# EasyEDA Pro project WEN-多通道电源模块mmk.epro, board PCB43
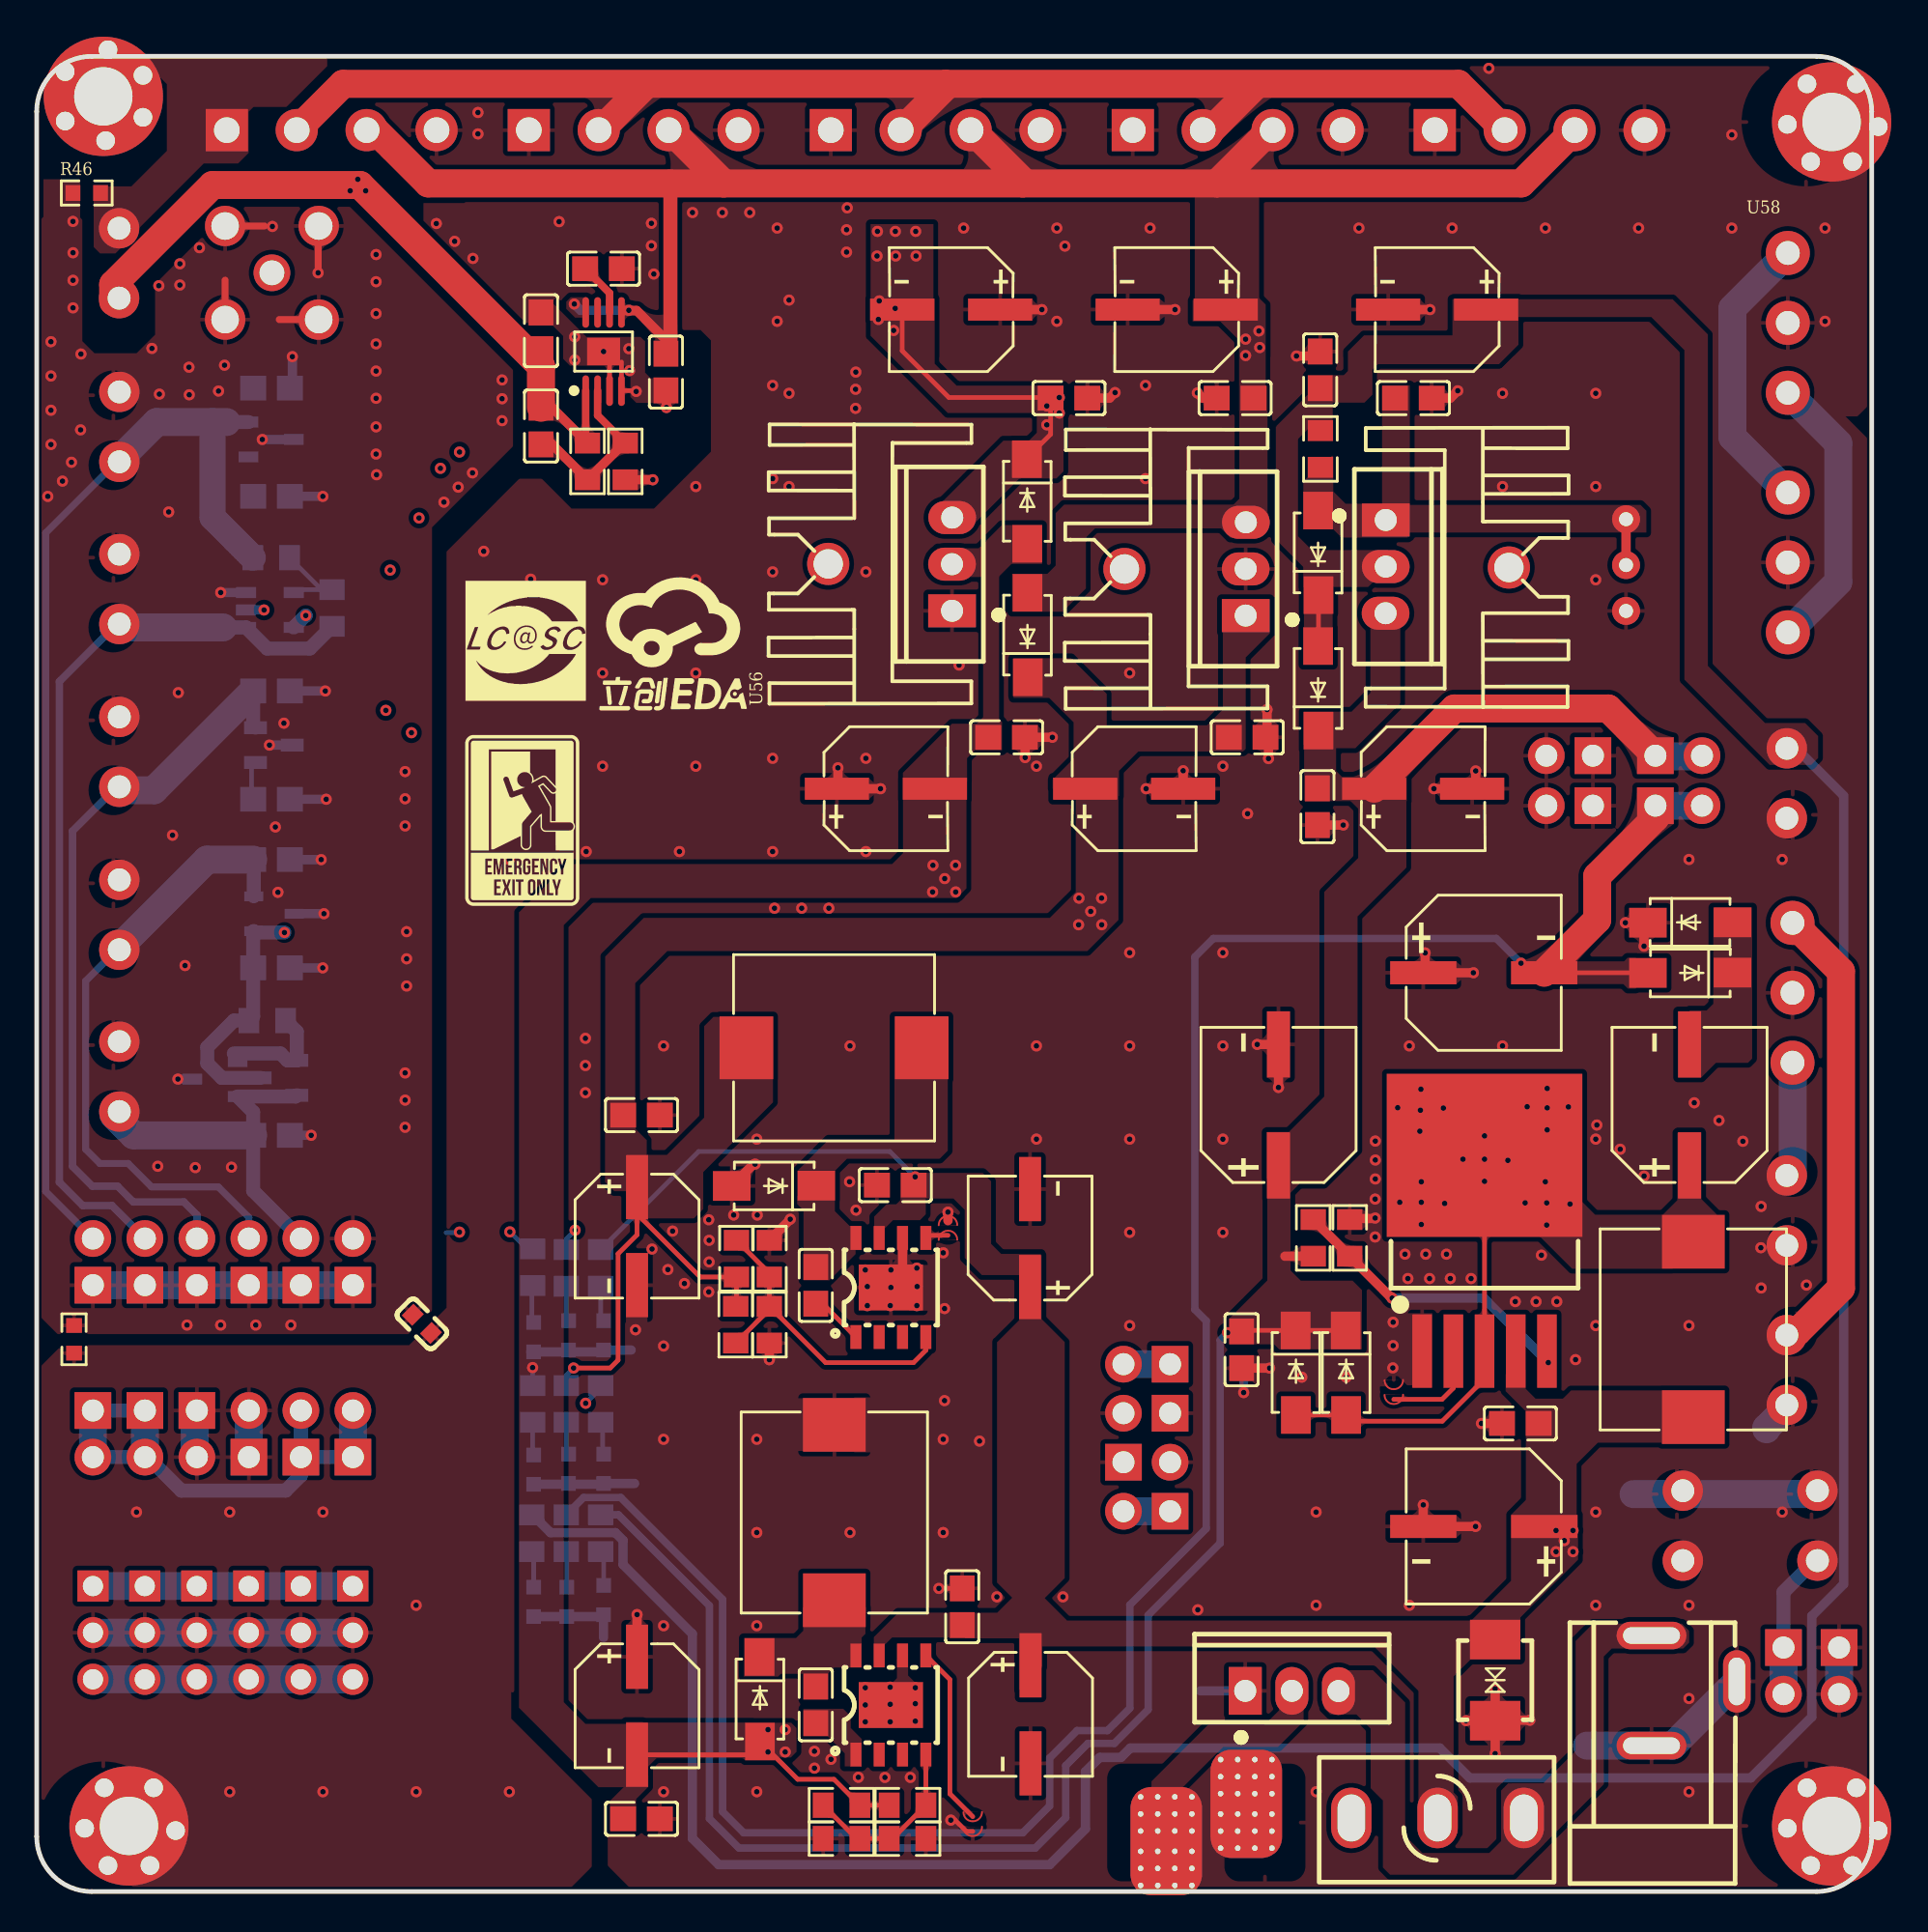
[diagram p6: board, top side]
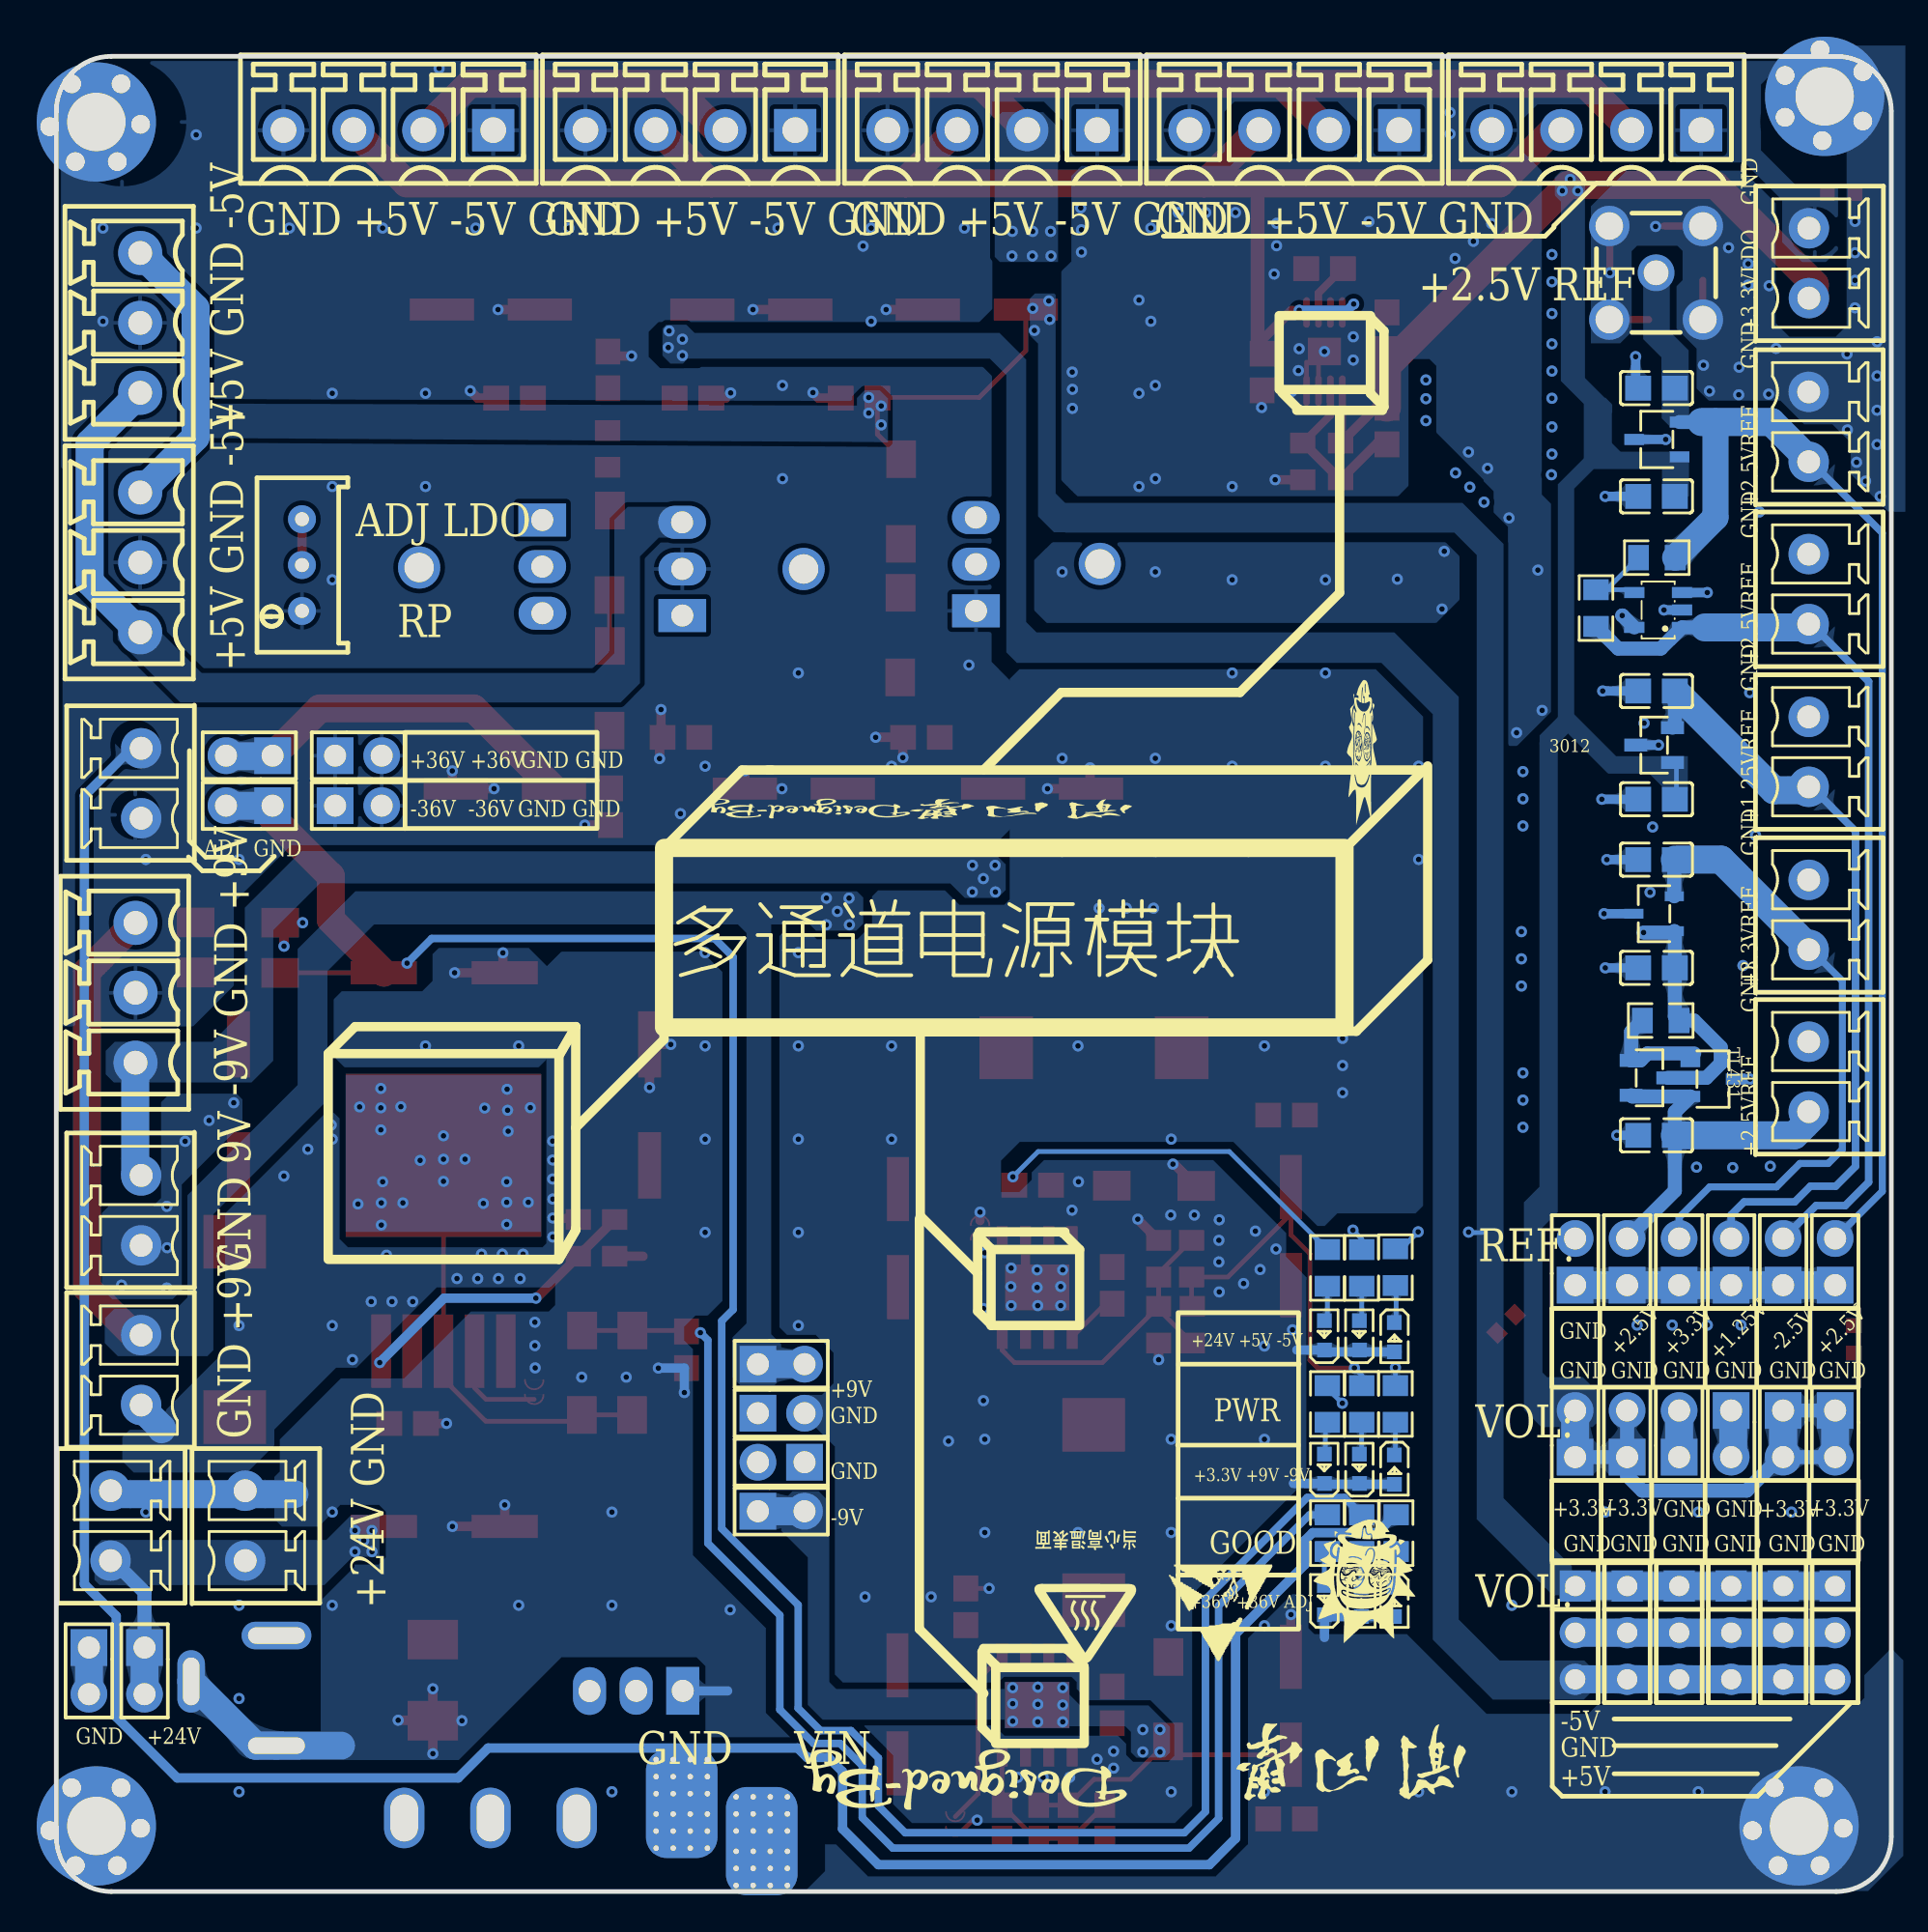
[diagram p7: board, bottom side, seen from below]

Outline 100 x 100 mm; copper layers: Top Layer, Inner1, Inner2, Bottom Layer. Coordinates in mm from the lower left corner of the outline.
Outline path: 0,97 0,3 arc(0.88,0.88) 3,0 97,0 arc(99.12,0.88) 100,3 100,97 arc(99.12,99.12) 97,100 3,100 arc(0.88,99.12) 0,97
Stack: Top Layer 0.035mm 外层铜厚1oz / Dielectric1 0.2104mm 7628 RC49% 8.6mil / Inner1 0.0152mm 内层铜厚 / Dielectric2 1.065mm 1.1mm H/HOZ Copper / Inner2 0.0152mm 内层铜厚 / Dielectric3 0.2104mm 7628 RC49% 8.6mil / Bottom Layer 0.035mm 外层铜厚1oz

## Design rules (mm)
net PGND: PWR
template: 自定义配置
spacing copperThickness1oz: track to track 0.102, other pairs 0 to 0.3
spacing copperThickness2oz: track to track 0.203, other pairs 0.152 to 0.3
spacing safeClearance1 (default): track to track 0.152, other pairs 0 to 0.3
track width copperThickness1oz (default): min 0.127, default 0.254, max 2.54
track width copperThickness2oz: min 0.203, default 0.254, max 2.54
track width PWR: min 0.127, default 0.508, max 2.54
differential pair differentialPair (default): width min 0.127, default 0.254, max 2.54; gap min 0.152, default 0.152
via viaSize (default): diameter min 0.5, default 0.61, max 10; hole min 0.3, default 0.305, max 6.299
net class PWR uses PWR
net PGND uses PWR

## Placement (name value [footprint] x y rotation side)
24V-IN2  DC-005-20A  [DC-IN-TH_DC-005-20A]  90.32 10.95 90 top
3012  REF3012AIDBZR  [SOT-23-3_L2.9-W1.3-P1.90-LS2.4-BR]  12.92 62.47 180 bottom
+  -  [外界焊盘R双面-M]  60.54 3.76 0 top
-  -  [外界焊盘R双面-M]  66.93 3.76 180 top
C15  100nF  [C0805]  56.25 81.38 180 top
C25  100nF  [C0805]  65.97 62.89 180 top
C27  100nF  [C0805]  65.3 81.38 0 top
C29  100nF  [C0805]  52.85 62.89 180 top
C30  10uF  [C0805]  12.8 41.21 180 bottom
C40  10uF  [C0805]  34.29 82.8 90 top
C41  10nF  [C0805]  30.89 88.43 180 top
C42  10nF  [C0805]  27.48 79.85 270 top
C43  100nF  [C0805]  46.79 38.49 0 top
C44  10nF  [C0805]  42.45 33.03 90 top
C45  100uF  [CAP-SMD_BD6.3-L6.6-W6.6-LS7.6-FD-1]  54.13 35.61 90 top
C46  100uF  [CAP-SMD_BD6.3-L6.6-W6.6-LS7.6-FD-1]  32.72 35.71 270 top
C47  100nF  [C0805]  50.44 15.52 270 top
C48  10nF  [C0805]  42.45 10.17 90 top
C49  100uF  [CAP-SMD_BD6.3-L6.6-W6.6-LS7.6-FD-1]  54.16 9.66 270 top
C50  100uF  [CAP-SMD_BD6.3-L6.6-W6.6-LS7.6-FD-1]  32.72 10.12 270 top
C51  10uF  [C0805]  27.48 85.04 270 top
C53  1uF 0805 50V  [C0805]  80.85 25.51 0 top
C60  1uF 0805 50V  [C0805]  65.66 29.52 90 top
C63  100nF  [C0805]  69.79 59.11 90 top
C73  220uF-50V  [CAP-SMD_BD8.0-L8.3-W8.3-LS9.1-FD]  78.86 19.89 180 top
C74  220uF-50V  [CAP-SMD_BD8.0-L8.3-W8.3-LS9.1-FD]  90.07 42.86 90 top
C75  220uF-50V  [CAP-SMD_BD8.0-L8.3-W8.3-LS9.1-FD]  78.86 50.06 0 top
C76  220uF-50V  [CAP-SMD_BD8.0-L8.3-W8.3-LS9.1-FD]  67.67 42.86 90 top
C77  100nF  [C0805]  12.8 76.02 180 bottom
C78  100nF  [C0805]  12.8 81.92 180 bottom
C79  100nF  [C0805]  12.8 50.33 180 bottom
C80  100nF  [C0805]  12.8 56.23 180 bottom
C81  100nF  [C0805]  12.8 59.52 180 bottom
C83  100nF  [C0805]  12.8 65.42 180 bottom
C84  100nF  [C0805]  32.96 3.96 0 top
C85  100nF  [C0805]  32.96 42.31 180 top
C86  100nF  [C0805]  75.02 81.38 180 top
C87  100nF  [C0805]  69.94 82.92 270 top
C88  100nF  [C0603]  20.99 30.93 315 top
CN7  WJ15EDGVC-3.81-4P  [CONN-TH_4P-P3.81_WJ2EDGVC-3.81-4P]  32.53 95.98 0 bottom
CN10  WJ15EDGVC-3.81-4P  [CONN-TH_4P-P3.81_WJ2EDGVC-3.81-4P]  16.08 95.98 0 bottom
CN11  WJ15EDGVC-3.81-4P  [CONN-TH_4P-P3.81_WJ2EDGVC-3.81-4P]  48.99 95.98 0 bottom
CN12  WJ15EDGVC-3.81-4P  [CONN-TH_4P-P3.81_WJ2EDGVC-3.81-4P]  65.45 95.98 0 bottom
CN14  WJ15EDGVC-3.81-4P  [CONN-TH_4P-P3.81_WJ2EDGVC-3.81-4P]  81.9 95.98 0 bottom
CN15  WJ15EDGVC-3.81-3P  [CONN-TH_3P-P3.81_WJ15EDGVC-3.81-3P]  95.43 72.42 270 bottom
CN16  WJ15EDGVC-3.81-3P  [CONN-TH_3P-P3.81_WJ15EDGVC-3.81-3P]  95.43 85.48 270 bottom
CN18  WJ15EDGVC-3.81-3P  [CONN-TH_3P-P3.81_WJ15EDGVC-3.81-3P]  95.68 48.97 270 bottom
D5  48V TVS  [DO-214AA_L4.4-W3.6-LS5.3-BI]  79.48 11.52 270 top
D15  SS54  [SMA_L4.3-W2.6-LS5.0-FD]  68.61 28.27 90 top
D16  SS54  [SMA_L4.3-W2.6-LS5.0-FD]  90.11 52.8 180 top
D17  SS54  [SMA_L4.3-W2.6-LS5.0-FD]  90.11 50.07 0 top
D18  SS54  [SMA_L4.3-W2.6-LS5.0-FD]  71.35 28.27 90 top
D21  SS54  [SMA_L4.3-W2.6-LS5.0-FD]  69.84 72.95 270 top
D22  SS54  [SMA_L4.3-W2.6-LS5.0-FD]  69.84 65.56 270 top
D24  SS54  [SMA_L4.3-W2.6-LS5.0-FD]  39.4 10.48 90 top
D25  SS54  [SMA_L4.3-W2.6-LS5.0-FD]  40.18 38.46 0 top
D28  SS54  [SMA_L4.3-W2.6-LS5.0-FD]  54 68.47 270 top
D29  SS54  [SMA_L4.3-W2.6-LS5.0-FD]  53.97 75.74 90 top
H1  PZ254V-11-02P  [HDR-TH_2P-P2.54-V-M]  14.4 34.31 90 bottom
H2  PZ254V-11-02P  [HDR-TH_2P-P2.54-V-M]  3.06 34.31 90 bottom
H3  PZ254V-11-02P  [HDR-TH_2P-P2.54-V-M]  11.56 34.31 90 bottom
H4  PZ254V-11-02P  [HDR-TH_2P-P2.54-V-M]  8.73 34.31 90 bottom
H5  PZ254V-11-02P  [HDR-TH_2P-P2.54-V-M]  5.9 34.31 90 bottom
H7  PZ254V-11-02P  [HDR-TH_2P-P2.54-V-M]  3.06 24.94 270 bottom
H8  PZ254V-11-02P  [HDR-TH_2P-P2.54-V-M]  60.49 23.39 0 bottom
H9  PZ254V-11-02P  [HDR-TH_2P-P2.54-V-M]  5.9 24.94 270 bottom
H10  PZ254V-11-02P  [HDR-TH_2P-P2.54-V-M]  83.54 61.89 180 bottom
H15  PZ254V-11-02P  [HDR-TH_2P-P2.54-V-M]  98.22 12.03 270 bottom
H16  PZ254V-11-02P  [HDR-TH_2P-P2.54-V-M]  95.19 12.03 270 bottom
H19  PZ254V-11-02P  [HDR-TH_2P-P2.54-V-M]  83.54 59.17 180 bottom
H20  PZ254V-11-02P  [HDR-TH_2P-P2.54-V-M]  60.49 28.74 180 bottom
H21  PZ254V-11-02P  [HDR-TH_2P-P2.54-V-M]  8.73 24.94 270 bottom
H22  PZ254V-11-02P  [HDR-TH_2P-P2.54-V-M]  60.49 20.72 180 bottom
H23  PZ254V-11-02P  [HDR-TH_2P-P2.54-V-M]  89.48 59.17 0 bottom
H24  PZ254V-11-02P  [HDR-TH_2P-P2.54-V-M]  89.48 61.89 0 bottom
H25  PZ254V-11-02P  [HDR-TH_2P-P2.54-V-M]  60.49 26.06 180 bottom
H26  PZ254V-11-03P  [HDR-TH_3P-P2.54-V-M]  3.07 14.11 270 bottom
H27  PZ254V-11-03P  [HDR-TH_3P-P2.54-V-M]  14.39 14.11 270 bottom
H28  PZ254V-11-03P  [HDR-TH_3P-P2.54-V-M]  5.89 14.11 270 bottom
H29  PZ254V-11-03P  [HDR-TH_3P-P2.54-V-M]  17.22 14.11 270 bottom
H30  PZ254V-11-03P  [HDR-TH_3P-P2.54-V-M]  8.72 14.11 270 bottom
H31  PZ254V-11-03P  [HDR-TH_3P-P2.54-V-M]  11.56 14.11 270 bottom
H32  PZ254V-11-02P  [HDR-TH_2P-P2.54-V-M]  14.4 24.94 90 bottom
H33  PZ254V-11-02P  [HDR-TH_2P-P2.54-V-M]  11.56 24.94 90 bottom
H34  PZ254V-11-02P  [HDR-TH_2P-P2.54-V-M]  17.23 24.94 90 bottom
H35  PZ254V-11-02P  [HDR-TH_2P-P2.54-V-M]  17.23 34.31 90 bottom
L10  47uH  [IND-SMD_L10.8-W10.0_SLO1040H]  90.28 30.63 270 top
L11  47uH  [IND-SMD_L10.8-W10.0_SLO1040H]  43.47 20.65 270 top
L12  47uH  [IND-SMD_L10.8-W10.0_SLO1040H]  43.45 45.98 0 top
LED1  NCD0805R1  [LED0603-RD_RED]  28.98 23.04 90 bottom
LED2  NCD0805R1  [LED0603-RD_RED]  27.08 22.99 270 bottom
LED3  -  [LED0603-RD_RED]  27.08 15.78 270 bottom
LED8  NCD0805R1  [LED0603-RD_RED]  30.89 15.88 90 bottom
LED9  NCD0805R1  [LED0603-RD_RED]  28.89 15.78 270 bottom
LED10  NCD0805R1  [LED0603-RD_RED]  30.89 23.04 90 bottom
LED11  NCD0805R1  [LED0603-RD_RED]  27.08 30.21 270 bottom
LED12  NCD0805R1  [LED0603-RD_RED]  28.98 30.31 90 bottom
LED13  NCD0805R1  [LED0603-RD_RED]  30.89 30.31 90 bottom
NC  10k  [R0805]  38.09 30.89 90 top
NC1  10k  [R0805]  39.93 30.89 90 top
NC2  10k  [R0805]  43.86 2.89 180 top
NC3  10k  [R0805]  43.86 4.7 180 top
Q2  IRF9640PBF  [TO-220-3_L10.0-W4.5-P2.54-L]  68.4 10.93 0 top
R2  1kΩ  [R0805]  28.86 26.57 90 bottom
R3  1kΩ  [R0805]  26.98 19.53 90 bottom
R5  1.2k  [R0805]  69.96 78.61 90 top
R6  1kΩ  [R0805]  27.02 26.57 270 bottom
R15  4.7kΩ  [R0805]  12.57 47.46 180 bottom
R22  10k  [R0805]  38.13 34.49 270 top
R23  1.58k  [R0805]  39.93 34.49 270 top
R24  10k  [R0805]  47.46 2.89 0 top
R25  1.58k  [R0805]  47.46 4.7 0 top
R34  100kΩ  [R0805]  32.07 77.93 90 top
R35  180kΩ  [R0805]  30.01 77.93 270 top
R36  56k  [R0805]  69.57 35.62 270 top
R37  2k  [R0805]  71.55 35.62 270 top
R38  20k  [R0805]  30.73 19.53 90 bottom
R39  20k  [R0805]  28.86 19.53 270 bottom
R40  10K 0.1%  [R0805]  16.09 69.94 270 bottom
R41  10K 0.1%  [R0805]  12.78 72.68 0 bottom
R42  20k  [R0805]  30.73 26.57 90 bottom
R43  20k  [R0805]  27.02 34.02 270 bottom
R44  20k  [R0805]  28.86 33.98 90 bottom
R45  20k  [R0805]  30.73 33.98 90 bottom
R46  -  [R0603]  2.73 92.55 0 top
R47  -  [R0603]  2.03 30.09 270 top
RF1  BWSMA-KE-Z001  [SMA-TH_BWSMA-KE-Z001]  12.82 88.2 180 bottom
RP1  20k  [RES-ADJ-TH_3P-L9.5-W4.85-P2.50-BL-BS]  86.61 72.28 0 bottom
SS8050  SS8050  [SOT-23-3_L2.9-W1.3-P1.90-LS2.4-BR]  13.18 44.34 0 bottom
SW3  -  [钮子开关]  37.99 -11.48 180 top
TL431  TL431AIDBZR  [SOT-23-3_L2.9-W1.6-P1.90-LS2.8-BR]  9.72 44.27 0 bottom
U3  LM7805CT  [TO-220-3_L10.0-W4.5-P2.54-L]  65.89 72.07 90 top
U4  LM317  [TO-220-3_L10.0-W4.5-P2.54-L]  73.51 72.19 270 top
U8  LM7905CT/NOPB  [TO-220-3_L10.0-W4.5-P2.54-L]  49.89 72.33 90 top
U12  TPS7A4901DGNR  [MSOP-8_L3.0-W3.0-P0.65-LS5.0-BL-EP]  30.89 83.91 0 top
U13  TPS5430DDAR  [ESOP-8_L4.9-W3.9-P1.27-LS6.0-TL-EP]  46.55 32.91 90 top
U14  TPS5430DDAR  [ESOP-8_L4.9-W3.9-P1.27-LS6.0-TL-EP]  46.55 10.16 90 top
U21  XL6019E1  [TO-263-5_L10.2-W9.9-P1.70-LS14.4-TL]  78.9 34.78 90 top
U22  EN  [短接调试焊盘]  74 27.25 270 top
U23  -  [散热片25*15*10]  74.15 72.02 270 top
U24  -  [【电赛】直插拔端子-2P-3.81mm]  95.7 60.58 270 bottom
U25  3025  [SOT-23-3_L2.9-W1.6-P1.90-LS2.8-BR]  12.78 79.12 180 bottom
U26  3033  [SOT-23-3_L3.0-W1.7-P0.95-LS2.9-BR]  12.93 53.28 180 bottom
U28  OPA376AIDBVR  [SOT-23-5_L3.0-W1.7-P0.95-LS2.8-BR]  12.71 69.83 180 bottom
U29  -  [【电赛】直插拔端子-2P-3.81mm]  4.18 44.22 90 bottom
U30  -  [【电赛】直插拔端子-2P-3.81mm]  4.18 79.62 90 bottom
U31  -  [【电赛】直插拔端子-2P-3.81mm]  4.18 53.03 90 bottom
U32  -  [【电赛】直插拔端子-2P-3.81mm]  4.18 61.91 90 bottom
U34  -  [【电赛】直插拔端子-2P-3.81mm]  4.18 70.78 90 bottom
U36  -  [【电赛】直插拔端子-2P-3.81mm]  4.17 88.54 90 bottom
U37  -  [短接调试焊盘]  49.61 36.13 90 top
U38  -  [短接调试焊盘]  51.06 3.7 270 top
U41  -  [【电赛】直插拔端子-2P-3.81mm]  89.38 19.75 90 bottom
U43  -  [【电赛】直插拔端子-2P-3.81mm]  95.7 28.6 270 bottom
U44  -  [【电赛】直插拔端子-2P-3.81mm]  95.7 37.3 270 bottom
U45  100uF_50V  [CAP-SMD_BD6.3-L6.6-W6.6-LS7.2-FD]  75.56 60.09 0 top
U46  100uF_50V  [CAP-SMD_BD6.3-L6.6-W6.6-LS7.2-FD]  76.32 86.2 180 top
U47  100uF  [CAP-SMD_BD6.3-L6.6-W6.6-LS7.2-FD]  62.12 86.2 180 top
U51  100uF  [CAP-SMD_BD6.3-L6.6-W6.6-LS7.2-FD]  59.81 60.09 0 top
U52  100uF  [CAP-SMD_BD6.3-L6.6-W6.6-LS7.2-FD]  46.28 60.09 0 top
U53  100uF  [CAP-SMD_BD6.3-L6.6-W6.6-LS7.2-FD]  49.83 86.2 180 top
U54  -  [散热片25*15*10]  65.35 72.19 90 top
U56  -  [散热片25*15*10]  49.21 72.47 90 top
U57  -  [My_M3螺丝孔]  3.63 96.42 90 top
U58  -  [My_M3螺丝孔]  96.42 96.42 0 top
U59  -  [My_M3螺丝孔]  96.42 3.58 0 top
U61  -  [My_M3螺丝孔]  3.63 3.58 0 top
U64  -  [【电赛】直插拔端子-2P-3.81mm]  96.72 19.75 90 bottom

## Footprints (pads in the part's own frame, mm; a bottom-side part is the same pattern mirrored in y, then rotated)
C0603
  rect 0.8x0.9 smd: 1(-0.7,0) 2(0.7,0)
C0805
  rect 1.41x1.35 smd: 1(-1,0) 2(1,0)
CAP-SMD_BD6.3-L6.6-W6.6-LS7.2-FD
  rect 3.5x1.2 smd: 1(-2.67,0) 2(2.67,0)
CAP-SMD_BD6.3-L6.6-W6.6-LS7.6-FD-1
  rect 3.5x1.2 smd: 1(-2.67,0) 2(2.67,0)
CAP-SMD_BD8.0-L8.3-W8.3-LS9.1-FD
  rect 3.61x1.26 smd: 1(-3.295,0) 2(3.295,0)
CONN-TH_3P-P3.81_WJ15EDGVC-3.81-3P
  round 2.4 hole 1.3: 1(-3.81,0) 2(0,0) 3(3.81,0)
CONN-TH_4P-P3.81_WJ2EDGVC-3.81-4P
  rect 2.3x2.3 hole 1.4: 1(-5.715,0)
  round 2.3 hole 1.4: 2(-1.905,0) 3(1.905,0) 4(5.715,0)
DC-IN-TH_DC-005-20A
  oval 1.5x3.8 hole 0.9x3.1: 1(3,2.325) 2(-3,2.325)
  oval 3.4x1.5 hole 2.6x0.9: 3(0.5,-2.325)
DO-214AA_L4.4-W3.6-LS5.3-BI
  rect 2.159x2.743 smd: 1(-2.21,0) 2(2.21,0)
ESOP-8_L4.9-W3.9-P1.27-LS6.0-TL-EP
  rect 1.3x0.6 smd: 1(-2.7,1.905) 2(-2.7,0.635) 3(-2.7,-0.635) 4(-2.7,-1.905) 5(2.7,-1.905) 6(2.7,-0.635) 7(2.7,0.635) 8(2.7,1.905)
  rect 2.5x3.5 smd: 9(0,0)
HDR-TH_2P-P2.54-V-M
  rect 2x2 hole 1.2: 1(-1.27,0)
  round 2 hole 1.2: 2(1.27,0)
HDR-TH_3P-P2.54-V-M
  rect 1.7x1.7 hole 1.1: 1(-2.54,0)
  round 1.7 hole 1.1: 2(0,0) 3(2.54,0)
IND-SMD_L10.8-W10.0_SLO1040H
  rect 2.924x3.42 smd: 1(4.778,0) 2(-4.778,0)
LED0603-RD_RED
  rect 0.8x0.8 smd: 1(-0.799,-0.004) 2(0.799,0.004)
MSOP-8_L3.0-W3.0-P0.65-LS5.0-BL-EP
  oval 0.364x1.662 smd: 1(-0.975,-2.131) 2(-0.325,-2.131) 3(0.325,-2.131) 4(0.975,-2.131) 5(0.975,2.131) 6(0.325,2.131) 7(-0.325,2.131) 8(-0.975,2.131)
  rect 1.8x1.5 smd: 9(0,0)
My_M3螺丝孔
  round 1.016 hole 1.021x1.016: 1(-1.016,-0.127) 1(0.051,2.078) 1(0.254,-2.159) 1(2.54,-2.159) 1(2.743,2.078) 1(3.937,-0.254)
  round 6.5 hole 3.18x3.175: 1(1.397,0)
R0603
  rect 0.806x0.864 smd: 1(-0.753,0) 2(0.753,0)
R0805
  rect 1.133x1.377 smd: 1(-1,0) 2(1,0)
RES-ADJ-TH_3P-L9.5-W4.85-P2.50-BL-BS
  round 1.524 hole 0.762: 1(0,2.5) 2(0,0) 3(0,-2.5)
SMA-TH_BWSMA-KE-Z001
  round 2.2 hole 1.5: 1(-2.55,-2.55) 2(-2.55,2.55) 3(2.55,2.55) 4(2.55,-2.55)
  round 2 hole 1.35: 5(0,0)
SMA_L4.3-W2.6-LS5.0-FD
  rect 2.046x1.62 smd: 1(-2.304,-0.009) 2(2.304,0.009)
SOT-23-3_L2.9-W1.3-P1.90-LS2.4-BR
  rect 1.25x0.7 smd: 1(1,-0.95) 2(1,0.95) 3(-1,0)
SOT-23-3_L2.9-W1.6-P1.90-LS2.8-BR
  rect 1.07x0.6 smd: 1(1.235,-0.95) 2(1.235,0.95) 3(-1.235,0)
SOT-23-3_L3.0-W1.7-P0.95-LS2.9-BR
  rect 1.038x0.532 smd: 1(1.101,-0.95) 2(1.101,0.95) 3(-1.101,0)
SOT-23-5_L3.0-W1.7-P0.95-LS2.8-BR
  rect 1.1x0.6 smd: 1(1.3,-0.95) 2(1.3,0) 3(1.3,0.95) 4(-1.3,0.95) 5(-1.3,-0.95)
TO-220-3_L10.0-W4.5-P2.54-L
  rect 1.8x2.6 hole 1.2: 1(-2.54,0.005)
  oval 1.8x2.6 hole 1.2: 2(0,0.005) 3(2.54,-0.005)
TO-263-5_L10.2-W9.9-P1.70-LS14.4-TL
  rect 4x1.069 smd: 1(-5.334,3.4) 2(-5.334,1.7) 3(-5.334,0) 4(-5.334,-1.7) 5(-5.334,-3.4)
  rect 8.89x10.66 smd: 6(5.334,0)
【电赛】直插拔端子-2P-3.81mm
  round 2.2 hole 1.25: 1(-1.718,0.323) 2(2.092,0.323)
外界焊盘R双面-M
  round 0.61 hole 0.305: 1(-0.381,1.397) 1(-0.381,0.468) 1(-0.381,-0.463) 1(-0.381,-1.569) 1(-0.381,-2.499) 1(-0.381,-3.429) 1(0.55,1.397) 1(0.55,0.468) 1(0.55,-0.463) 1(0.55,-1.569) 1(0.55,-2.499) 1(0.55,-3.429) 1(1.482,1.397) 1(1.482,0.468) 1(1.482,-0.463) 1(1.482,-1.569) 1(1.482,-2.499) 1(1.482,-3.429) 1(2.413,1.397) 1(2.413,0.468) 1(2.413,-0.463) 1(2.413,-1.569) 1(2.413,-2.499) 1(2.413,-3.429)
  rrect 3.9x5.9 smd: 1(1.016,-1.016)
  rrect 3.9x5.9 smd far side: 1(1.016,-1.016)
散热片25*15*10
  round 2.3 hole 1.6: 1(-0.127,6.075)
短接调试焊盘
  custom 0.505x1.01 smd: 1(-0.379,-0.046)
  custom 0.506x1.01 smd: 2(0.427,-0.046)
钮子开关
  oval 2.2x3.3 hole 1.5x2.56: 1(-38.353,-15.494) 2(-33.653,-15.494) 3(-43.053,-15.494)

## Nets
As in the schematic, except:
+1.25V_REF: 3012.2 C83.2 H4.2 U32.1
+2.5V_REFA: C30.2 H1.2 SS8050.2 TL431.2 U29.1
+3.3V_LDO: 3012.1 C42.1 C51.2 C77.2 C81.2 H7.1 H7.2 H9.1 H9.2 H32.1 H32.2 H34.1 H34.2 R35.1 R42.2 U12.1 U25.1 U36.1
+5V_LDO: C27.2 C40.2 C79.2 CN7.3 CN10.3 CN11.3 CN12.3 CN14.3 CN15.3 CN16.3 D28.1 H26.3 H27.3 H28.3 H29.3 H30.3 H31.3 R15.2 R44.2 SS8050.3 U3.3 U12.5 U12.8 U26.1 U28.5 U47.1
GND: 3012.3 C30.1 C77.1 C78.1 C79.1 C80.1 C81.1 C83.1 C88.1 H1.1 H2.1 H3.1 H4.1 H5.1 H35.1 H35.2 R46.1 R47.1 RF1.1 RF1.2 RF1.3 RF1.4 TL431.3 U25.3 U26.3 U28.3 U29.2 U30.2 U31.2 U32.2 U34.2 U57.1
$1N1897: R15.1 SS8050.1 TL431.1
$3N15558: +.1 Q2.2

Pads without a net: SW3 2; U12 7; U13 2 3; U14 2 3; U23 1; U54 1; U56 1

## Via types
v1: diameter 0.61, hole 0.305, Top Layer to Bottom Layer, 414 vias

## Routing (per net, layer and track width the routed paths; a pad name or vN(x,y) marks a point on that pad's centre or on a via; arc(x,y) is an arc through that point)
+1.25V_REF: length 42.2
  Bottom Layer w0.406: H4.2 8.73,36.87 8.02,37.58 5.26,37.58 4.41,38.43 3.03,38.43 1.95,39.51 1.95,57.78 4.18,60.01
  Bottom Layer w0.762: 3012.2 11.8,63.55 C83.2
  Bottom Layer w1.524: 4.18,60.01 6.39,60.01 11.59,65.21
+2.5V_REF: length 61.4
  Bottom Layer w0.381: H2.2 0.49,38.15 0.49,74.03 4.18,77.72
  Bottom Layer w0.762: U25.2 10.35,80.07
  Bottom Layer w1.423: 9.58,80.07 9.58,74.88 R41.1
  Bottom Layer w1.524: 4.18,77.72 6.53,80.07 10.35,80.07
+2.5V_REFA: length 20.5
  Bottom Layer w0.762: H1.2 11.8,38.18 C30.2 11.8,42.47 TL431.2 14.11,43.32 SS8050.2
  Bottom Layer w1.524: 4.18,42.31 5.28,41.21 C30.2
+3.3V_LDO: length 85.3
  Top Layer w0.406: U12.1 29.92,79.02
  Top Layer w0.508: C51.2 27.48,83.12 ; R35.1 29.92,79.02 28.09,80.85 C42.1
  Top Layer w1.524: 4.17,86.63 4.17,87.57 9.58,92.99 17.62,92.99 27.48,83.12 C42.1
  Inner2 w0.254: H34.2 17.62,26.61 v1(29.92,26.61)
  Bottom Layer w0.254: v1(29.92,26.61) 30.73,27.42 R42.2 ; 11.59,61.52 11.71,61.4 11.71,59.52
  Bottom Layer w0.762: H7.1 H9.1 ; H32.1 H34.1 ; H32.1 H32.2 ; H32.1 14.4,22.67 13.57,21.85 7.88,21.85 6.05,23.67 H9.2 H7.2
  Bottom Layer w1.524: H9.1 H9.2 ; H7.1 H7.2 ; H34.2 H34.1
  vias: v1(17.08,92.67) v1(17.5,93.3) v1(17.93,92.67)
+3.3V_REF: length 34.6
  Bottom Layer w0.381: 4.18,51.13 2.67,49.62 2.67,40.45 3.44,39.67 4.98,39.67 6.25,38.4 9.9,38.4 11.56,36.73 H3.2
  Bottom Layer w0.762: C80.2 11.83,56.2 U26.2
  Bottom Layer w1.524: 4.18,51.13 9.28,56.23 C80.2
+5V_LDO: length 254.6
  Top Layer w0.508: 31.96,86.14 31.97,86.15 32.69,86.15 34.29,84.55 C40.2
  Top Layer w0.762: C40.2 34.53,84.04 34.53,93.08
  Top Layer w1.524: 53.73,93.08 53.73,93.2 50.96,95.98 ; 53.73,93.08 64.32,93.08 ; 53.73,93.08 37.44,93.08 ; CN14.3 80.91,93.08 64.32,93.08 ; 64.32,93.08 67.22,95.98 67.51,95.98 ; 37.44,93.08 21.34,93.08 18.44,95.98 CN10.3 ; 37.44,93.08 34.53,95.98
  Inner2 w0.254: 19.47,89.92 26.14,83.26 26.14,78.59 21.64,74.09 21.64,38.52 22.44,37.72 27.66,37.72 v1(29.34,36.04)
  Inner2 w0.762: v1(13.5,52.26) 14.66,53.42 v1(14.66,69.53) 19.47,74.34 19.47,95.07 18.56,95.98 CN10.3
  Bottom Layer w0.254: U3.3 66.25,74.61 ; R44.2 28.86,35.56 v1(29.34,36.04)
  Bottom Layer w0.508: v1(32.27,86.16) 29.64,86.16 v1(29.3,86.5)
  Bottom Layer w0.762: v1(13.5,52.26) 11.9,52.26 U26.1 11.8,52.3 C79.2 11.8,47.69 R15.2 10.75,47.46 9.29,46 9.29,45.13 10.08,44.34 SS8050.3 ; v1(14.66,69.53) 14.65,69.53 U28.5
  Bottom Layer w1.524: H29.3 H27.3 H31.3 H30.3 H28.3 H26.3 ; CN16.3 98.18,78.91 98.18,71.37 CN15.3
  vias: v1(65.88,84.59) v1(65.88,83.7) v1(66.6,85.04) v1(66.65,84.13)
+9V_DCDC: length 49.2
  Top Layer w0.254: 32.72,36.92 C46.1 ; 32.72,36.92 36.15,33.49 R22.2 38.13,31.93 NC.2 ; 32.72,36.92 32.72,35.79 31.68,34.75 31.68,28.96 31.25,28.53 v1(29.26,28.53)
  Top Layer w1.524: CN18.1 98.32,50.14 98.32,32.88 95.95,30.51 95.7,30.51
  Bottom Layer w0.254: R2.2 28.86,28.13 v1(29.26,28.53)
  Bottom Layer w1.524: H20.2 H20.1
  vias: v1(56.8,54.13) v1(56.78,52.68) v1(57.44,53.41) v1(58.03,54.13) v1(58.04,52.68)
+24V_DCDC: length 28.1
  Top Layer w0.254: C53.2 82.15,25.21
  Bottom Layer w0.254: R45.2 36.07,40.32 46.49,40.32 v1(47.87,38.94)
  Bottom Layer w0.762: 96.72,17.84 95.19,16.32 H16.1
  Bottom Layer w1.524: H16.1 H16.2
  vias: v1(82.8,19.67) v1(82.8,18.52) v1(83.25,19.12) v1(83.72,19.67) v1(83.72,18.52)
+36V_DCDC: length 99.9
  Top Layer w0.254: D18.2 D15.2 65.71,30.58 C60.2
  Top Layer w0.406: C60.2 65.05,30.52
  Top Layer w0.508: R36.2 68.02,34.62
  Top Layer w1.524: H24.1 85.64,64.47 77.26,64.47 U45.1
  Bottom Layer w0.406: R38.2 31.71,20.53 36.66,15.57 36.66,3.98 38.27,2.37 54.42,2.37 56.08,4.03 56.08,6.86 57.29,8.07 58.73,8.07 60.57,9.91 60.57,15.06 64.49,18.98 64.49,30.05 v1(64.9,30.45)
  Bottom Layer w1.524: 90.69,61.86 88.15,61.86
-2.5V_REF: length 50.3
  Bottom Layer w0.406: 4.18,68.88 1.23,65.93 1.23,38.65 2.51,37.38 4.1,37.38 H5.2
  Bottom Layer w0.762: R40.2 14.89,67.73 12.56,67.73 U28.1 10.16,68.88
  Bottom Layer w1.524: 4.18,68.88 4.18,68.88 10.16,68.88
-5V_LDO: length 159
  Top Layer w0.254: 53.9,78.05 55.25,79.4 C15.2 55.22,81.41 49.71,81.41 47.17,83.95 47.17,86.2
  Top Layer w1.524: 49.54,98.5 49.54,98.37 47.15,95.98 ; 49.54,98.5 16.69,98.5 CN10.2 ; 49.54,98.5 77.48,98.5 CN14.2 ; 66.24,98.22 64,95.98 63.7,95.98 ; 30.72,95.98 33.02,98.27
  Inner2 w0.254: v1(23.04,35.93) 25.77,35.93 v1(25.78,35.95)
  Inner2 w0.762: CN10.2 14.17,94.4 17.61,90.96 17.61,75.05 v1(12.39,69.83)
  Bottom Layer w0.254: v1(23.04,35.93) 23.01,35.9 22.31,35.9 ; v1(25.78,35.95) 26.75,34.98 26.98,34.98
  Bottom Layer w0.508: U28.2 v1(12.39,69.83)
  Bottom Layer w1.524: CN15.1 92.41,79.25 92.41,86.27 CN16.1 ; H29.1 H27.1 H31.1 H30.1 H28.1 H26.1
  vias: v1(45.79,89.12) v1(45.82,90.46) v1(45.86,85.66) v1(45.91,86.67) v1(46.7,85.06) v1(46.79,90.46) v1(46.79,86.27) v1(46.81,89.12) v1(47.9,90.46) v1(47.92,89.12) v1(55.05,80.95) v1(55.05,79.92) v1(55.73,81.41) v1(55.73,80.56)
-9V_DCDC: length 25
  Top Layer w0.254: R25.1 NC3.1 43.45,6.12 41.47,6.12 D24.1 38.69,7.45 C50.2
  Bottom Layer w0.254: R6.1 27.02,28.6
  Bottom Layer w1.524: 95.7,39.21 95.7,45.15 CN18.3 ; H22.2 H22.1
  vias: v1(27.02,28.55) v1(39.85,8.82) v1(39.85,7.61) v1(40.79,8.82) v1(40.79,7.61) v1(45.15,11.11) v1(45.15,10.17) v1(45.15,9.25) v1(46.51,11.14) v1(46.51,10.2) v1(46.51,9.25) v1(47.88,11.11) v1(47.88,10.24) v1(47.88,9.28) v1(48.84,55.92) v1(48.82,54.47) v1(49.48,55.2) v1(50.07,55.92) v1(50.08,54.47)
-36V_DCDC: length 131.3
  Top Layer w0.254: C75.2 87.79,50.06 D17.1
  Top Layer w1.524: H23.1 88.21,58.5 85.04,55.33 85.04,52.95 C75.2
  Bottom Layer w0.406: v1(80.89,50.59) 79.54,51.93 64.12,51.93 63.11,50.93 63.11,31.71 63.74,31.09 63.74,19.78 59.57,15.62 59.57,9.99 58.35,8.77 56.69,8.77 55.2,7.28 55.2,4.66 53.74,3.2 38.52,3.2 37.38,4.35 37.38,15.92 31.83,21.47 29.8,21.47 R39.1
  Bottom Layer w1.524: 88.21,59.16 90.75,59.16
GND: length 41
  Top Layer w0.381: RF1.3 12.41,90.75 ; 15.34,88.49 15.34,90.63 ; RF1.1 13.22,85.65 ; RF1.4 10.27,87.8
  Bottom Layer w0.508: C30.1 v1(14.96,41.21) ; U26.3 v1(15.65,53.28) ; C80.1 v1(15.5,56.23) ; 14,79.12 v1(12.29,79.12) ; TL431.3 v1(7.7,44.27) ; 3012.3 v1(12.68,62.47) ; 13.89,76.02 v1(15.59,76.02) ; 14.02,65.42 v1(15.73,65.42) ; 13.93,81.93 v1(13.93,83.64) ; 14.07,59.52 v1(15.78,59.52) ; U28.3 v1(10.03,70.78) ; v1(15.59,50.33) C79.1
  Bottom Layer w1.524: H35.1 H1.1 H3.1 H4.1 H5.1 H2.1
  vias: v1(0.6,76.02) v1(0.78,84.45) v1(0.78,82.58) v1(0.78,80.72) v1(0.78,78.85) v1(1.4,76.85) v1(1.89,77.88) v1(1.98,91) v1(1.98,89.3) v1(1.98,87.8) v1(1.98,86.29) v1(2.39,79.65) v1(2.41,83.78) v1(6.28,84.08) v1(6.6,39.52) v1(6.66,87.5) v1(6.68,81.59) v1(7.19,75.17) v1(7.4,57.56) v1(7.8,88.69) v1(7.8,87.54) v1(7.72,65.33) v1(8.08,50.46) v1(8.19,30.87) v1(8.3,83.06) v1(8.31,81.56) v1(8.64,39.45) v1(8.87,89.57) v1(9.91,81.76) v1(10.03,30.87) v1(10.24,83.17) v1(10.61,39.47) v1(11.94,30.87) v1(12.84,90.73) v1(13.01,58.01) v1(13.15,54.45) v1(13.47,63.66) v1(13.85,30.87) v1(15.33,88.2) v1(18.49,89.2) v1(18.49,87.72) v1(18.49,85.98) v1(18.49,84.33) v1(18.49,82.85) v1(18.49,81.37) v1(18.49,79.81) v1(18.49,78.33) v1(18.52,77.2) v1(20.08,61.03) v1(20.08,59.54) v1(20.08,58.06) v1(20.08,44.61) v1(20.08,43.13) v1(20.08,41.64) v1(20.16,52.3) v1(20.16,50.82) v1(20.16,49.34) v1(22.19,75.71) v1(22.97,76.52) v1(23.75,77.3) v1(25.36,82.37) v1(25.36,81.34) v1(25.36,80.15)
PGND: length 138.3
  Top Layer w0.254: 32.49,81.78 U12.4 31.87,83.34 ; U38.2 50.66,3.28 50.05,3.89 v1(49.82,3.89) ; v1(30.89,83.91) 31.22,83.59 31.22,81.78 ; C47.1 v1(49.16,16.52)
  Top Layer w0.508: 72.94,36.67 71.61,36.67 R37.1 ; v1(87.59,51.51) 87.59,52.58 D16.2 v1(86.58,52.79) ; D5.2 79.51,9.34 v1(81.37,9.34) ; D5.2 v1(77.89,9.31) ; D5.2 v1(79.48,11.05) ; D5.2 v1(79.48,7.51) ; v1(45.98,60.09) U52.1 43.66,60.15 v1(43.66,61.23) ; v1(67.13,61.73) 67.13,62.73 C25.1 67.05,62.98 v1(67.05,64.41) ; C27.1 63.53,81.38 v1(63.25,81.66) ; C63.1 v1(71.2,58.11) ; C87.1 69.7,83.67 v1(68.65,83.67) ; C15.1 58.46,81.38 v1(58.77,81.68) ; 78.42,60.38 v1(78.42,61.06) ; v1(78.29,50.06) C75.1 75.66,50.16 v1(75.66,51.15) ; C53.1 v1(78.73,25.51) ; v1(53.87,61.79) 53.87,62.88 C29.1 v1(55.35,62.89) ; v1(62.48,61.07) 62.48,60.09 v1(60.46,60.09) ; v1(77.44,81.78) 77.04,81.38 C86.1 ; U13.6 47.18,33.55 v1(46.55,32.91) ; v1(66.51,46.16) C76.2 v1(67.67,43.81) ; v1(39.15,39.64) 39.07,39.64 D25.1 ; R23.1 41.06,36.62 v1(41.06,36.64) ; v1(34.32,80.86) 34.32,81.77 C40.1 ; U37.2 v1(49.66,37.02) ; 78.23,60.09 v1(76.14,60.09) ; C50.1 v1(32.72,15.09) ; U47.2 v1(62.03,86.2) ; C60.1 v1(67.19,28.52) ; NC1.1 v1(39.93,28.98) ; v1(78.41,19.89) C73.2 v1(75.56,21.07) ; U46.2 v1(75.93,86.2) ; R34.1 v1(33.58,76.93) ; U53.1 v1(54.78,86.2)
  Bottom Layer w0.508: 65.86,10.94 63.42,10.94 ; LED3.2 LED9.2 30.79,14.99 LED8.1 30.89,13.85 ; v1(67.19,28.52) 65.77,28.52 v1(65.77,27.19) ; 26.93,29.41 30.79,29.41 LED13.1 32.39,29.51 ; 32.58,22.24 LED10.1 30.84,22.19 LED2.2
  Bottom Layer w1.524: 95.7,26.7 94.26,25.26 94.26,25.19 ; 8.54,26.21 8.62,26.14 8.62,23.75 8.54,23.67 ; H33.2 H33.1 ; H29.2 H27.2 H31.2 H30.2 H28.2 H26.2 ; 87.02,21.65 96.72,21.65 ; 84.48,7.95 24V-IN2.2 89.15,7.95 92.65,11.45 ; H15.1 H15.2
  vias: v1(5.44,20.68) v1(10.52,20.68) v1(10.52,5.44) v1(15.6,20.68) v1(15.6,5.44) v1(19.03,64.36) v1(19.26,72.01) v1(20.42,63.14) v1(20.68,15.6) v1(20.68,5.44) v1(20.83,74.85) v1(21.78,90.89) v1(22,77.55) v1(22.77,89.92) v1(23.04,78.44) v1(23.77,88.99) v1(24.05,96.94) v1(24.05,95.77) v1(24.36,73.03) v1(24.49,69.88) v1(25.76,61.32) v1(25.76,56.24) v1(25.76,5.44) v1(26.92,71.51) v1(28.47,90.99) v1(29.32,84.72) v1(29.32,83.45) v1(29.9,46.49) v1(29.9,45.01) v1(29.9,43.53) v1(29.95,56.67) v1(30.84,71.48) v1(30.84,66.4) v1(30.84,61.32) v1(32.27,84.07) v1(32.31,82.88) v1(32.67,81.74) v1(32.63,30.61) v1(33.5,90.9) v1(33.5,89.68) v1(33.53,35.01) v1(33.63,88.14) v1(34.16,46.08) v1(34.16,29.72) v1(34.16,24.64) v1(34.16,14.48) v1(34.16,5.44) v1(34.4,33.89) v1(34.65,35.99) v1(35.03,56.67) v1(35.3,33.13) v1(35.74,91.49) v1(35.92,76.56) v1(35.92,71.48) v1(35.92,66.4) v1(35.92,61.32) v1(36.62,36.6) v1(36.64,35.49) v1(36.64,34.31) v1(36.62,32.67) v1(37.36,91.49) v1(37.98,36.86) v1(38.86,91.49) v1(39.24,41) v1(39.27,36.86) v1(39.24,24.64) v1(39.24,19.56) v1(39.24,14.48) v1(39.24,5.44) v1(40.11,82.07) v1(40.11,76.99) v1(40.11,71.91) v1(40.11,61.75) v1(40.11,56.67) v1(40.21,53.58) v1(40.35,90.64) v1(40.35,85.56) v1(41,86.72) v1(41,81.64) v1(41,76.56) v1(41.69,53.58) v1(42.38,7.64) v1(42.38,6.73) v1(43.17,53.58) v1(43.28,7.21) v1(44.17,91.74) v1(44.13,90.55) v1(44.13,89.33) v1(44.3,38.68) v1(44.32,46.08) v1(44.32,19.56) v1(44.64,82.8) v1(44.62,81.86) v1(44.62,80.82) v1(44.65,37.13) v1(44.78,6.23) v1(45.19,71.91) v1(45.19,61.75) v1(45.19,56.67) v1(45.16,33.87) v1(45.27,32.97) v1(45.27,31.93) v1(46.22,6.22) v1(46.55,33.87) v1(46.52,31.93) v1(47.61,6.22) v1(47.96,33.97) v1(47.98,32.97) v1(47.96,31.93) v1(49.4,34.8) v1(49.4,24.64) v1(49.4,19.56) v1(49.47,31.77) v1(49.47,26.75) v1(50.27,66.83) v1(50.51,90.64) v1(51.38,24.54) v1(52.33,16.06) v1(54.48,61.32) v1(54.48,46.08) v1(54.48,41) v1(55.59,90.64) v1(55.59,85.56) v1(55.92,16.06) v1(56.03,89.66) v1(59.56,66.4) v1(59.56,51.16) v1(59.56,46.08) v1(59.56,41) v1(59.56,35.92) v1(59.56,30.84) v1(60.43,82.07) v1(60.43,76.99) v1(60.67,90.64) v1(63.27,15.35) v1(64.64,61.32) v1(64.64,51.16) v1(64.64,46.08) v1(64.64,41) v1(64.64,35.92) v1(65.99,58.73) v1(68.94,28.03) v1(69.72,20.68) v1(69.72,15.6) v1(69.72,5.44) v1(71.36,28.03) v1(72.06,90.64) v1(72.95,40.89) v1(72.95,39.86) v1(72.95,38.83) v1(72.94,37.73) v1(72.94,36.7) v1(72.94,35.67) v1(73.9,28.53) v1(73.92,31.02) v1(73.92,29.75) v1(74.56,34.73) v1(74.8,46.08) v1(74.72,33.4) v1(74.8,15.6) v1(75.7,34.73) v1(75.9,33.4) v1(76.83,34.73) v1(77.03,33.4) v1(77.14,90.64) v1(78.17,33.4) v1(79.14,99.34) v1(79.88,81.64) v1(79.88,76.56) v1(79.88,46.08) v1(80.58,32.15) v1(81.71,32.15) v1(82,34.68) v1(82.22,90.64) v1(82.84,32.15) v1(83.86,28.98) v1(84.96,81.64) v1(84.96,76.56) v1(84.96,71.48) v1(84.96,41) v1(84.96,30.84) v1(84.96,20.68) v1(84.96,15.6) v1(85.02,41.77) v1(86.29,40.45) v1(87.3,90.64) v1(87.59,38.99) v1(90.04,56.24) v1(90.04,30.84) v1(90.04,15.6) v1(90.04,10.52) v1(90.04,5.44) v1(90.33,42.98) v1(91.67,42.01) v1(92.38,95.72) v1(92.38,90.64) v1(92.98,40.88) v1(93.97,37.33) v1(93.96,35.08) v1(93.97,32.89) v1(95.12,56.24) v1(95.12,20.68) v1(96.44,33.04) v1(97.46,90.64) v1(97.46,85.56)
ADJ_LDO: length 149.1
  Top Layer w0.254: D21.2 69.85,67.89 D22.1
  Bottom Layer w0.508: R3.2 27.03,20.53 28,19.55 31.53,19.55 31.95,19.14 31.95,17.82 35.73,14.04 35.73,2.9 37.17,1.46 55.2,1.46 57.15,3.42 57.15,6.53 57.93,7.31 59.09,7.31 59.6,7.82 76.47,7.82 78.09,6.19 93.41,6.19 96.73,9.51 96.73,15.01 98.47,16.75 98.47,59.71 95.7,62.48
$1N1897: length 6
  Bottom Layer w0.762: R15.1 14.18,46.85 SS8050.1 13.67,45.29 13.29,45.67 10.74,45.67
$1N4188: length 4.6
  Bottom Layer w0.254: 15.52,70.94 14.16,70.94 U28.4 ; 15.52,70.94 R40.1 ; 15.52,70.94 R41.2
$2N620: length 2.8
  Top Layer w0.254: 73.73,81.38 C86.2
  Top Layer w0.508: RP1.3 RP1.2
$3N6694: length 17.9
  Top Layer w0.254: U13.4 48.45,29.49 47.78,28.82 43,28.82 NC1.2 ; NC1.2 R23.2 39.93,33.69 R22.1 ; NC1.2 39.93,31.72 NC.1
$3N6711: length 2.9
  Top Layer w0.254: C44.1 42.83,32.03 U13.1
$3N6713: length 9.9
  Top Layer w0.254: NC3.2 44.67,2.89 NC2.1 R24.1 46.64,2.89 R25.2 48.46,7.46 U14.4
$3N11385: length 23.6
  Top Layer w0.254: U21.6 v1(78.9,38.7) U21.3 78.9,27.93 76.6,25.63 71.7,25.63 D18.1 D15.1
  vias: v1(74.17,42.71) v1(74.28,37.56) v1(75.37,41.43) v1(75.43,43.72) v1(75.41,42.57) v1(75.45,38.68) v1(75.45,37.56) v1(75.45,36.35) v1(76.66,42.69) v1(76.73,37.49) v1(77.72,39.91) v1(78.9,41.18) v1(78.9,39.91) v1(80.17,39.84) v1(81.11,37.53) v1(81.22,42.76) v1(82.21,38.68) v1(82.29,37.53) v1(82.29,36.32) v1(82.31,43.76) v1(82.31,42.7) v1(82.31,41.5) v1(83.47,42.75) v1(83.56,37.46)
$3N11493: length 16
  Top Layer w0.508: R36.1 71.55,34.63 R37.2 73.76,32.41 73.78,32.41 v1(73.86,32.33)
  Bottom Layer w0.508: v1(73.86,32.33) 78.87,32.33 v1(82.37,28.82)
$3N14235: length 1.3
  Top Layer w0.254: U13.5 48.59,35.76 U37.1
$3N14616: length 9.8
  Top Layer w0.254: U38.1 49.77,5.33 49.77,11.55 U14.5
$3N15475: length 5.5
  Top Layer w0.254: U21.2 77.2,27.44 76.58,26.82 U22.2
$4N2290: length 2.9
  Top Layer w0.406: C41.2 31.22,87.1 31.22,86.04
$4N2295: length 10
  Top Layer w0.406: R34.2 30.57,80.43 U12.2
  Top Layer w0.508: 27.48,78.43 27.48,78.58 27.84,78.94 28,78.94 R35.2 32.01,78.93 R34.2
$6N513: length 2
  Bottom Layer w0.254: LED3.1 27.08,18.43 R3.1
$6N518: length 1.7
  Bottom Layer w0.254: 28.86,23.84 28.86,25.56 R2.1
$6N519: length 1.8
  Bottom Layer w0.254: 27.01,23.79 27.02,23.8 R6.2
$6N528: length 1.9
  Bottom Layer w0.254: 31,18.53 30.9,18.42 LED8.2
$6N530: length 2
  Bottom Layer w0.254: R39.2 28.89,18.5 LED9.1
$6N823: length 1.8
  Bottom Layer w0.254: 30.84,23.84 30.84,25.46 R42.1
$6N825: length 2
  Bottom Layer w0.254: 26.94,31.01 26.98,31.05 26.98,32.98
$6N831: length 1.9
  Bottom Layer w0.254: R44.1 28.86,31.14 28.82,31.11
$6N984: length 1.9
  Bottom Layer w0.254: LED13.2 30.73,31.27 R45.1

## Copper pours and planes (outline as drawn; the poured copper is in the pictures)
+2.5V_REF on Bottom Layer: 11.04,88.2 13.52,88.2 13.52,82.57 11.04,82.57
+2.5V_REF on Bottom Layer: 11.02,82.62 12.51,82.62 12.51,79.8 11.02,79.8
+3.3V_LDO on Bottom Layer: 11.09,78.38 18.17,78.38 18.17,59.97 11.09,59.97
+3.3V_LDO on Bottom Layer: 11.03,78.46 12.5,78.46 12.5,76.02 11.03,76.02
+3.3V_LDO on Bottom Layer: 17.57,64.59 19.17,64.59 19.17,62.53 17.57,62.53
+3.3V_LDO on Bottom Layer: 11.76,81.4 16.76,81.4 16.76,77.51 11.76,77.51
+3.3V_LDO on Bottom Layer: 15.95,63.61 20.02,63.61 20.02,25.31 15.95,25.31
+3.3V_LDO on Bottom Layer: 15.21,93.75 18.34,93.75 18.34,80.58 15.21,80.58
+5V_LDO on Top Layer: 64.78,82.04 67.07,82.04 67.07,74.57 64.78,74.57
+5V_LDO on Top Layer: 53.15,75.57 67.13,75.57 67.13,69.74 53.15,69.74
+5V_LDO on Top Layer: 28.86,86.87 29.96,86.87 29.96,85.76 28.86,85.76
+5V_LDO on Top Layer: 63.11,93.46 66.62,93.46 66.62,86.2 63.11,86.2
+5V_LDO on Top Layer: 62.99,86.85 66.98,86.85 66.98,80.67 62.99,80.67
+5V_LDO on Bottom Layer: 16.06,85.37 66.97,85.37 66.97,10.46 16.06,10.46
+5V_LDO on Bottom Layer: 65.4,75.45 96.65,75.45 96.65,64.79 65.4,64.79
+9V_DCDC on Top Layer: 53.23,67.21 58.31,67.21 58.31,61.48 53.23,61.48
+9V_DCDC on Top Layer: 55.36,70.39 67.2,70.39 67.2,59.7 55.36,59.7
+9V_DCDC on Top Layer: 30.97,42.99 33.25,42.99 33.25,38.16 30.97,38.16
+9V_DCDC on Top Layer: 30.98,60.55 58.95,60.55 58.95,41.98 30.98,41.98
+9V_DCDC on Top Layer: 36.37,47.66 38.41,47.66 38.41,42.02 36.37,42.02
+9V_DCDC on Top Layer: 32.31,46.48 40.13,46.48 40.13,36.68 32.31,36.68
+9V_DCDC on Bottom Layer: 56.02,54.5 97.36,54.5 97.36,29.17 56.02,29.17
+9V_DCDC on Bottom Layer: 60.49,53.51 63.32,53.51 63.32,27.6 60.49,27.6
+24V_DCDC on Top Layer: 45.64,39.16 48.45,39.16 48.45,35.77 45.64,35.77
+24V_DCDC on Top Layer: 54.37,16.54 75.81,16.54 75.81,10.42 54.37,10.42
+24V_DCDC on Top Layer: 50.56,16.57 53.71,16.57 53.71,13.8 50.56,13.8
+24V_DCDC on Top Layer: 45.62,15.2 50.02,15.2 50.02,13.45 45.62,13.45
+24V_DCDC on Top Layer: 52.33,34.68 56.02,34.68 56.02,10.96 52.33,10.96
+24V_DCDC on Top Layer: 48.32,39.16 54.73,39.16 54.73,33.59 48.32,33.59
+24V_DCDC on Top Layer: 80.05,28.44 91.97,28.44 91.97,20.39 80.05,20.39
+24V_DCDC on Top Layer: 75.3,14.76 80.83,14.76 80.83,3.17 75.3,3.17
+24V_DCDC on Top Layer: 78.17,20.53 84,20.53 84,13.59 78.17,13.59
+24V_DCDC on Bottom Layer: 82.39,20.51 97.92,20.51 97.92,16.7 82.39,16.7
+36V_DCDC on Top Layer: 69.05,70.06 74.31,70.06 74.31,62.3 69.05,62.3
+36V_DCDC on Top Layer: 69.07,62.74 74.67,62.74 74.67,59.42 69.07,59.42
+36V_DCDC on Top Layer: 67.02,60.69 74.64,60.69 74.64,37.82 67.02,37.82
+36V_DCDC on Top Layer: 64.99,41.36 72.22,41.36 72.22,29.54 64.99,29.54
-5V_LDO on Top Layer: 45.44,86.8 55.96,86.8 55.96,80.56 45.44,80.56
-5V_LDO on Top Layer: 48.68,79.06 53.63,79.06 53.63,74.24 48.68,74.24
-5V_LDO on Top Layer: 53.14,82.04 55.96,82.04 55.96,77 53.14,77
-5V_LDO on Top Layer: 45.44,90.86 48.87,90.86 48.87,86.4 45.44,86.4
-5V_LDO on Bottom Layer: 44.88,87.08 46.94,87.08 46.94,74.07 44.88,74.07
-5V_LDO on Bottom Layer: 54.68,81.08 93.16,81.08 93.16,78.98 54.68,78.98
-5V_LDO on Bottom Layer: 16.53,75.67 45.02,75.67 45.02,16.15 16.53,16.15
-5V_LDO on Bottom Layer: 45.41,96.96 48.86,96.96 48.86,88.79 45.41,88.79
-5V_LDO on Bottom Layer: 54.68,81.8 56.37,81.8 56.37,80.8 54.68,80.8
-9V_DCDC on Top Layer: 32.11,9.24 39,9.24 39,5.7 32.11,5.7
-9V_DCDC on Top Layer: 48.7,74.46 54.79,74.46 54.79,71.63 48.7,71.63
-9V_DCDC on Top Layer: 39.73,9.2 41.41,9.2 41.41,7.3 39.73,7.3
-9V_DCDC on Top Layer: 31.23,6.41 33.33,6.41 33.33,3.33 31.23,3.33
-9V_DCDC on Top Layer: 51.16,72.07 52.61,72.07 52.61,62.18 51.16,62.18
-9V_DCDC on Top Layer: 46.65,13.25 47.86,13.25 47.86,11.4 46.65,11.4
-9V_DCDC on Top Layer: 26.28,60.71 50.67,60.71 50.67,5.68 26.28,5.68
-9V_DCDC on Top Layer: 47.2,63.63 52.56,63.63 52.56,60.48 47.2,60.48
-9V_DCDC on Bottom Layer: 46.07,21.81 60.49,21.81 60.49,9.36 46.07,9.36
-9V_DCDC on Bottom Layer: 39.31,11.04 46.58,11.04 46.58,7.29 39.31,7.29
-9V_DCDC on Bottom Layer: 44.78,11.42 48.32,11.42 48.32,8.89 44.78,8.89
-9V_DCDC on Bottom Layer: 48.26,56.68 97.3,56.68 97.3,44.09 48.26,44.09
-36V_DCDC on Top Layer: 82.68,50.88 87.15,50.88 87.15,49.2 82.68,49.2
GND on Top Layer: 0.37,93.3 2.37,93.3 2.37,89.95 0.37,89.95
GND on Top Layer: 6.45,87.59 10.66,91.8 17.06,91.8 25.95,82.91 25.95,78.75 21.54,74.34 21.54,31.65 20.26,30.37 1.14,30.37 0.06,31.45 0.06,90.95 0.79,91.69 1.9,91.69 2.49,91.1 2.49,84.48 3.14,83.82 5.44,83.82 6.45,84.83
GND on Bottom Layer: -0.76,100.59 16.37,100.59 16.37,75.18 -0.76,75.18
GND on Inner2: 6.4,87.63 10.61,91.84 17.01,91.84 25.9,82.95 25.9,78.79 21.49,74.38 21.49,31.69 20.19,30.39 1.11,30.39 0,31.49 0,90.99 0.74,91.73 1.85,91.73 2.44,91.14 2.44,84.52 3.09,83.86 5.39,83.86 6.4,84.87
PGND on Top Layer: 1.37,29.77 20.29,29.77 22.33,31.81 22.33,73.01 26.3,76.98 27.53,76.98 29.15,75.35 33.63,75.35 36.74,78.47 36.74,90.05 38.4,91.7 44.39,91.7 44.82,91.28 44.82,77.34 41.05,73.58 41.05,58.19 39.87,57.01 28.4,57.01 25.7,54.31 25.7,37.34 25.2,36.84 25.2,35.23 25.86,34.57 25.86,9.42 30.25,5.03 30.25,1.35 28.8,-0.1 1.31,-0.1 -0.51,1.72 -0.51,27.89
PGND on Top Layer: 44.55,34.15 53.26,34.15 53.26,23.93 44.55,23.93
PGND on Top Layer: 26.78,86.77 34.77,86.77 34.77,81.12 26.78,81.12
PGND on Top Layer: 3.1,100.04 15.83,100.04 15.83,89.26 3.1,89.26
PGND on Top Layer: 38.94,60.45 29.61,60.45 24.76,55.6 24.76,11.96 31.12,5.61 31.12,1.41 32.45,0.07 99.47,0.07 100.26,0.86 100.26,78.69 95.27,83.68 46.82,83.68 45.9,84.61 38.94,84.61
PGND on Top Layer: 15.74,99.47 30.12,85.08 36.17,85.08 37.03,84.23 37.03,84.07 45.43,84.07 49.13,80.38 99.22,80.38 99.92,81.08 99.92,98.72 99.18,99.47
PGND on Top Layer: 21.07,92 33.83,92 33.83,85.48 21.07,85.48
PGND on Top Layer: 66,31.51 76.06,31.51 76.06,27.29 66,27.29
PGND on Top Layer: 32.11,32.7 45.2,32.7 45.2,24.01 32.11,24.01
PGND on Bottom Layer: 48.99,98.16 48.99,86.23 49.7,85.52 67.18,85.52 67.71,84.99 67.71,83.62 66.89,82.8 65.15,82.8 64.87,83.08 49.5,83.08 49.01,82.58 49.01,81.9 57.4,81.9 58.08,81.21 95.92,81.21 99.86,77.28 99.86,100.29 98.77,101.38 52.58,101.38 51.17,99.97 50.8,99.97
PGND on Bottom Layer: 61.33,51.21 88.12,51.21 88.12,7.17 61.33,7.17
PGND on Bottom Layer: 72.63,42.42 96.4,42.42 96.4,22.83 72.63,22.83
PGND on Bottom Layer: 89.86,43.48 97.52,43.48 97.52,32.28 89.86,32.28
PGND on Bottom Layer: 49.03,82.01 49.03,67.01 48.01,65.98 48.01,57.89 48.88,57.02 87.19,57.02 90.32,53.89 90.32,49.36 92.55,47.14 99.66,47.14 99.66,82.37 97.58,84.45 96.14,83.01 49.49,83.01 49.49,82.46
PGND on Bottom Layer: 31.87,39.86 46.83,39.86 46.83,33.32 31.87,33.32
PGND on Bottom Layer: 20.18,96.58 20.18,94.9 19.04,93.76 19.04,76.12 18.54,75.62 18.54,64.27 20.39,62.43 20.89,62.43 20.89,74.36 21.67,75.14 21.67,76.3 22.23,76.86 22.23,76.93 24.79,79.5 24.79,83.13 25.16,83.5 26.05,83.5 26.31,83.25 26.31,76.6 26.87,76.03 44.36,76.03 45.23,76.91 45.23,88.28 44.68,88.83 44.68,93.49 44.15,94.03 36.02,94.03 35.62,94.42 29.39,94.42 28.66,95.16 21.6,95.16
PGND on Bottom Layer: 5.51,100.08 5.51,100.06 7.1,98.46 7.1,94.87 5.25,93.02 2.9,93.02 2.9,89.45 3.56,88.8 4.87,88.8 5.95,89.87 5.95,92.16 8.01,94.22 11.74,94.22 12.07,94.55 12.07,97.38 19.28,97.38 20.16,96.5 20.16,95.33 21.16,94.33 28.18,94.33 28.85,95 28.85,96.21 30.17,97.53 35.79,97.53 36.33,96.99 36.33,94.81 36.84,94.31 44.55,94.31 45.14,94.91 45.14,96.49 46.18,97.53 52.07,97.53 52.73,96.86 52.73,95.06 53.55,94.24 61.57,94.24 61.9,94.58 61.9,97.29 62.31,97.7 68.52,97.7 69.24,96.98 69.24,95.33 70.4,94.17 77.37,94.17 78.16,94.96 78.16,97 78.92,97.75 85.21,97.75 85.77,97.19 85.77,95.17 86.64,94.3 88.95,94.3 89.8,95.15 89.8,98.95 88.67,100.08
PGND on Bottom Layer: 60,12.97 65.31,12.97 65.31,8.41 60,8.41
PGND on Bottom Layer: 25.52,66.6 60.59,66.6 60.59,3.73 25.52,3.73
PGND on Bottom Layer: 73.12,51.41 84.88,51.41 84.88,44.91 73.12,44.91
PGND on Bottom Layer: 24.29,73.52 45.7,73.52 45.72,73.52 46.71,72.55 46.71,69.81 46.02,69.12 24.79,69.12 23.53,70.38 23.53,72.77
PGND on Bottom Layer: -0.66,16.2 59.19,16.2 59.19,0.03 -0.66,0.03
PGND on Inner1: -0.2,101.41 102.2,101.41 102.2,-2.36 -0.2,-2.36
PGND on Inner2: -1.18,102.16 100.52,102.16 100.52,-1.52 -1.18,-1.52
ADJ_LDO on Top Layer: 77.15,86.76 97.08,86.76 97.08,61.39 77.15,61.39
ADJ_LDO on Top Layer: 69.06,70.92 70.62,70.92 70.62,66.94 69.06,66.94
ADJ_LDO on Top Layer: 69.29,82.58 70.63,82.58 70.63,79.68 69.29,79.68
ADJ_LDO on Top Layer: 70.26,86.76 80.75,86.76 80.75,81.13 70.26,81.13
ADJ_LDO on Top Layer: 67.53,79.82 69.82,79.82 69.82,72.07 67.53,72.07
ADJ_LDO on Top Layer: 69.02,73.1 73.99,73.1 73.99,71.08 69.02,71.08
ADJ_LDO on Top Layer: 67.54,81.54 70.49,81.54 70.49,78.9 67.54,78.9
$2N620 on Top Layer: 73.66,75.56 87.72,75.56 87.72,74.05 73.66,74.05
$2N620 on Top Layer: 69.03,78.25 74.73,78.25 74.73,73.78 69.03,73.78
$2N620 on Top Layer: 73.31,82.07 74.83,82.07 74.83,74.42 73.31,74.42
$3N6699 on Top Layer: 41.47,47.69 49.65,47.69 49.65,39.27 41.47,39.27
$3N6699 on Top Layer: 41.44,38.44 44.97,38.44 44.97,33.3 41.44,33.3
$3N6717 on Top Layer: 38.53,15.49 45.2,15.49 45.2,10.44 38.53,10.44
$3N6729 on Top Layer: 41.78,9.96 44.96,9.96 44.96,6.82 41.78,6.82
$3N9511 on Top Layer: 79.86,14.6 90.05,14.6 90.05,2.22 79.86,2.22
$3N9511 on Top Layer: 70.15,12.06 82.16,12.06 82.16,0.92 70.15,0.92
$3N11385 on Top Layer: 88.59,41.34 91.98,41.34 91.98,36.86 88.59,36.86
$3N11385 on Top Layer: 81.91,37.85 89.15,37.85 89.15,33.94 81.91,33.94
$3N11385 on Bottom Layer: 73.57,44.5 84.23,44.5 84.23,35.93 73.57,35.93
$3N12168 on Top Layer: 90.07,53.62 93.48,53.62 93.48,44.36 90.07,44.36
$3N15558 on Top Layer: 60.75,10.66 69.04,10.66 69.04,5.57 60.75,5.57

Small or netless copper shapes (teardrops, artwork), in the pictures only: 197 on Top Layer, 213 on Bottom Layer, 8 on Inner2

## Text on the board
Bottom Silkscreen Layer: +3.3V +9V -9V | +24V +5V -5V | +36V +36V ADJ | +2.5V | -2.5V | +1.25V | +3.3V | +3.3VLDO    GND | +2.5VREF      GND | +2.5VREF    GND | +1.25VREF   GND | +3.3VREF     GND | +2.5VREF       GND | GND | +9V | -9V | GND    +24V | GND GND | +36V +36V | -36V  -36V | ADJ  GND | +5V | -5V | PWR | GOOD | REF: | VOL: | +2.5V REF | GND +5V -5V GND | +5V GND -5V | +24V GND | GND 9V | GND +9V | -9V GND +9V | GND     VIN | RP | ADJ LDO | 多通道电源模块
